# Altium schematic sheet ONBOARD CURRENT SHUNT MONITOR.SchDoc
size 190 x 228 mm; SheetNumber: 4; SheetTotal: 8
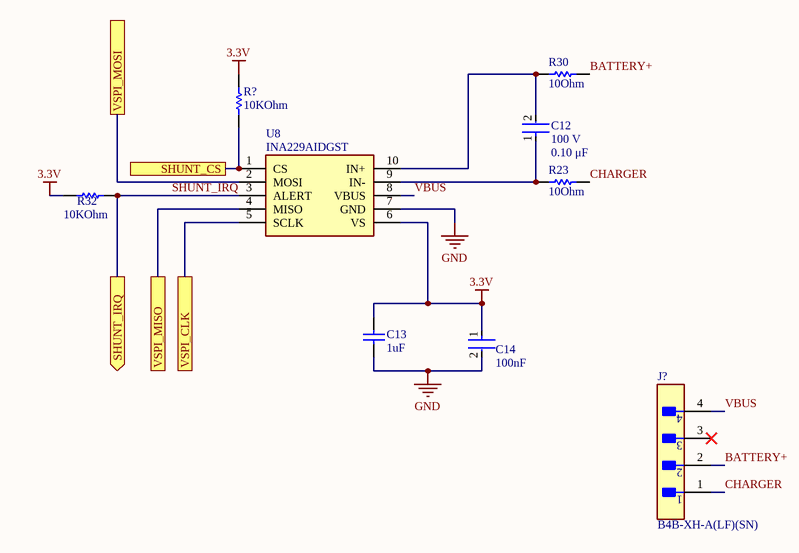
[diagram p0: ONBOARD CURRENT SHUNT MONITOR.SchDoc]

## Parts
C12  Voltage Rating: 100 V  Capacitance: 0.10 μF  [FP-C1206C-EB-MFG]  (hidden comment: C1206C104K1RACTU)
C13  Capacitance: 1uF  [CAPC2013X145X50LL20T25]  (hidden comment: C0805C105K4PACTU)
C14  Capacitance: 100nF  [FP-GRM033-0_03-IPC_C]  (hidden comment: GRM033R61A104KE15D)
J?  B4B-XH-A(LF)(SN)  [FP-B4B-XH-A_LF_SN-MFG]
R23  Resistance: 10Ohm  [RESC3225X70X50LL20T20]  (hidden comment: ERJ-14NF10R0U)
R30  Resistance: 10Ohm  [RESC3225X70X50LL20T20]  (hidden comment: ERJ-14NF10R0U)
R32  Resistance: 10KOhm  [RESC1005X40X25LL05T05]  (hidden comment: ERJ2RKF1002X)
R?  Resistance: 10KOhm  [RESC1005X40X25LL05T05]  (hidden comment: ERJ2RKF1002X)
U8  INA229AIDGST  [SOP50P490X110-10N]

## Ports
SHUNT_CS, SHUNT_IRQ (out), VSPI_CLK, VSPI_MISO, VSPI_MOSI

## Nets
3.3V: C13.1 C14.1 R32.2 R?.1 U8.6(VS)
GND: C13.2 C14.2 U8.7(GND)
BATTERY+: J?.2 R30.1
CHARGER: J?.1 R23.1
SHUNT_CS: R?.2 U8.1(CS) ; port SHUNT_CS
SHUNT_IRQ: R32.1 U8.3(ALERT) ; port SHUNT_IRQ
VBUS: J?.4 U8.8(VBUS)
VSPI_CLK: U8.5(SCLK) ; port VSPI_CLK
VSPI_MISO: U8.4(MISO) ; port VSPI_MISO
VSPI_MOSI: U8.2(MOSI) ; port VSPI_MOSI
NetC12_1: C12.1 R23.2 U8.9(IN-)
NetC12_2: C12.2 R30.2 U8.10(IN+)

Not connected (* = marked no-connect by the designer): J? 3*

## Library data of the parts
C12 = CMP-03020-000153-1: CAP CER 0.1UF 100V X7R 1206; Manufacturer: KEMET; Value: 0.10 μF; Tolerance: 0.1; Material: Ceramic; Temperature Coefficient: 15%; Automotive Grade: Grade 0; Automotive: Yes; Ipc Land Pattern Name: CAPC320160X78; Device Class L1: Passive Components; ComponentLink2Description: Datasheet; Temperature Range Low: -55°C; Category: Cap; Octopart: https://octopart.com/c1206c104k1ractu-kemet-89521; Height: 0.88mm; Lead Free: Yes; Digikey Description: CAP CER 0.1UF 100V X7R 1206; Mouser Description: CAP CER 0.1UF 100V X7R 1206; Device Class L3: Ceramic Capacitors; Device Class L2: Capacitors; ComponentLink2URL: https://content.kemet.com/datasheets/KEM_C1007_X8R_ULTRA_150C_SMD.pdf; Temperature Range High: +150°C; Temperature Characteristic: X7R; Manufacturer Part Number: C1206C104K1RACTU; RoHS: TRUE; Package: C1206C-EB; Temperature: -55°C to +150°C
C13 = CMP-1036-04746-2: Manufacturer: Kemet; Part Number: C0805C105K4PACTU
C14 = CMP-2010-01264-2: Chip Multilayer Ceramic Capacitors for General Purpose, 0201, 0.10uF, X5R, 15%, 10%, 10V; Mount: Surface Mount; Dielectric: X5R; Width: 0.012inch; Tolerance: 10%; Radiation Hardening: No; Voltage Rating: 10V; REACH SVHC: No SVHC; Height: 0.3mm; Max Operating Temperature: 85°C; Voltage Rating (DC): 10V; Thickness: 0.013inch; Termination: SMD/SMT; Lead Free: Lead Free; Package Quantity: 1; Case/Package: 0201; Min Operating Temperature: -55°C; Weight: 6E-06oz; Length: 0.6mm; Case Code (Imperial): 0201; Depth: 0.3mm; Voltage: 10V; Packaging: Tape and Reel; Case Code (Metric): 0603
J? = CMP-17439-000250-1: CONN HEADER VERT 4POS 2.5MM; Number of Contacts: 4; Contact Resistance: 20mR; Voltage Rating: 250V; Max Current Rating: 3A; Gender: Male; Wire/Cable Gauge: 22AWG; Mated Stacking Heights: 9.8mm; Insulation Resistance: 1GR; Orientation: Straight; Contact Type: Male Pin; Contact Finish - Mating: TIN; Series: XH; Max Voltage Rating (AC): 250V; Lead Pitch: 2.5mm; Contact Shape: Square; Insulation Color: Natural; Termination: Solder; Lead Free: Lead Free; Voltage Rating (AC): 250V; Number of Rows: 1; Flammability Rating: UL94 V-0; Number of Positions: 4; Max Operating Temperature: 85°C; Package Quantity: 500; Mount: Through Hole; REACH SVHC: No SVHC; Connector Type: Header; Insulation Material: Nylon; Fastening Type: Detent; Min Operating Temperature: -25°C; Housing Color: White; Packaging: Bulk; Contact Plating: Tin; Contact Material: Brass; Max Voltage Rating (DC): 250V; Housing Material: Polyamide; Color: Natural; Material: Polyamide; Pitch: 2.5mm; Depth: 5.75mm; Current Rating: 3A; Length: 12.4mm
R23 R30 = CMP-1015-00284-2: Manufacturer: Panasonic; Part Number: ERJ-14NF10R0U
R32 R? = CMP-2000-07588-1: Chip Resistor, 10 KOhm, +/- 1%, 0.1 W, -55 to 155 degC, 0402 (1005 Metric), RoHS, Tape and Reel; Manufacturer: Panasonic; Power Rating: 100mW; Voltage Rating: 50V; Case\/Package: 0402; Temperature Coefficient: 100ppm\/degreesC; RoHSCompliant: True; Lead Free: LeadFree; Package Quantity: 1; Contact Plating: Tin; Length: 1mm; Radiation Hardening: No; REACH SVHC: NoSVHC; Max Operating Temperature: 155degC; Depth: 0.5mm; Case Code (Imperial): 0402; Military Standard: Not; Package Description: 2-Pin Surface Mount Device, Body 1 x 0.5 mm; Termination: SMD/SMT; Case Code (Metric): 1005; Height: 0.35mm; Packaging: TapeandReel; Voltage Rating (DC): 50V; Package Reference: 402; Number of Pins: 2; Tolerance: 1%; Mounting Technology: SurfaceMount; Width: 0.02inch; Mount: SurfaceMount; Datasheet URL: https://industrial.panasonic.com/cdbs/www-data/pdf/RDA0000/AOA0000C304.pdf; Composition: ThickFilm; Datasheet Version: 02/2017; Manufacturer URL: http://www.panasonic.com/; Max Power Dissipation: 100mW; Number of Terminations: 2; Min Operating Temperature: -55degC
U8 = INA229AIDGST: Integrated Circuit; Manufacturer_Name: Texas Instruments; Datasheet Link: https://www.ti.com/lit/ds/symlink/ina229.pdf?ts=1623484017616&ref_url=https%253A%252F%252Fwww.google.com%252F; Height: 1.1mm; Manufacturer_Part_Number: INA229AIDGST; Mouser Part Number: 595-INA229AIDGST; Mouser Price/Stock: https://www.mouser.co.uk/ProductDetail/Texas-Instruments/INA229AIDGST?qs=eP2BKZSCXI5pgVbVXaUSbg%3D%3D